# Altium schematic sheet originalPSU48.SchDoc
size A; SheetNumber: 10; SheetTotal: 10
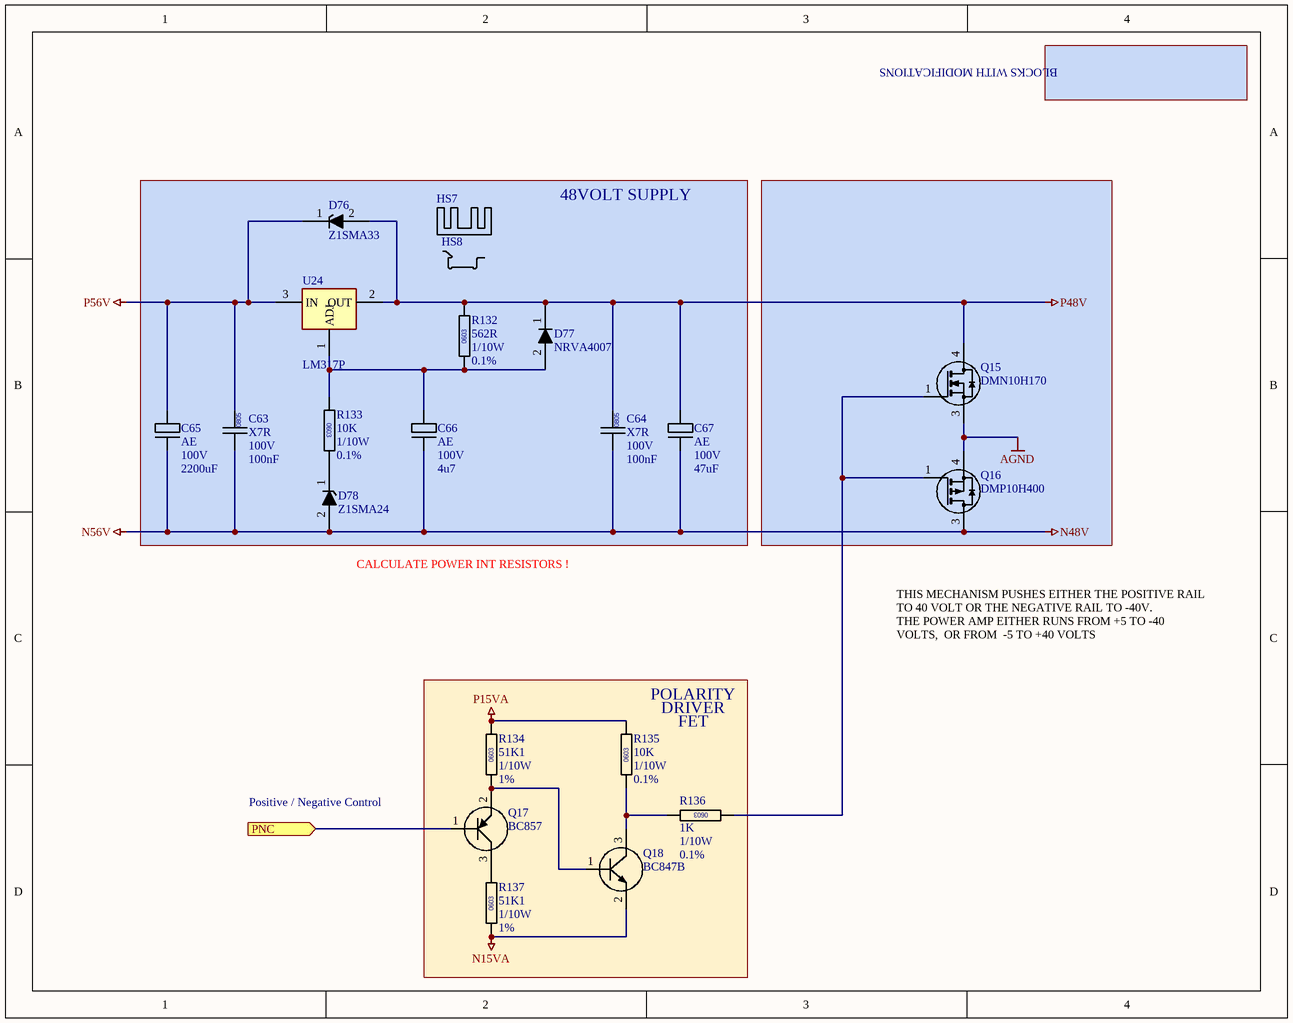
[diagram p0: originalPSU48.SchDoc]

## Parts
C63  Dielectric: X7R  Voltage: 100V  Capacitance: 100nF  [CAPC0805]  (hidden comment: CAP0805)
C64  Dielectric: X7R  Voltage: 100V  Capacitance: 100nF  [CAPC0805]  (hidden comment: CAP0805)
C65  Dielectric: AE  Voltage: 100V  Capacitance: 2200uF  [CAPAE-NICHICON-LGY2A222MELC30]  (hidden comment: CAP0603)
C66  Dielectric: AE  Voltage: 100V  Capacitance: 4u7  [CAPAE-PANASONIC-ECA-2AM4R7I]  (hidden comment: CAP0603)
C67  Dielectric: AE  Voltage: 100V  Capacitance: 47uF  [CAPAE-KEMET-ESL476M100AH9AA]  (hidden comment: CAP0603)
D76  Z1SMA33  [DO214AC]
D77  NRVA4007  [DO214AC]
D78  Z1SMA24  [DO214AC]
HS7  HEATSINK-CUI-HSS06-C20-P32  [HEATSINK-CUI-HSS06-C20-P32]  (value not drawn)
HS8  HEATSINK-CUI-HSC-05  [HEATSINK-CUI-HSS06-C20-P32]  (value not drawn)
Q15  DMN10H170  [DPAK]
Q16  DMP10H400  [DPAK]
Q17  BC857  [SOT23]
Q18  BC847B  [SOT23]
R132  value 562R  Power: 1/10W  Tolerance: 0.1%  [RESC0603]  (hidden comment: RESC0603)
R133  value 10K  Power: 1/10W  Tolerance: 0.1%  [RESC0603]  (hidden comment: RESC0603)
R134  value 51K1  Power: 1/10W  Tolerance: 1%  [RESC0603]  (hidden comment: RESC0603)
R135  value 10K  Power: 1/10W  Tolerance: 0.1%  [RESC0603]  (hidden comment: RESC0603)
R136  value 1K  Power: 1/10W  Tolerance: 0.1%  [RESC0603]  (hidden comment: RESC0603)
R137  value 51K1  Power: 1/10W  Tolerance: 1%  [RESC0603]  (hidden comment: RESC0603)
U24  LM317P  [TO220V-OVERMOLD]

## Blocks framed on the sheet
48VOLT SUPPLY: C63-C67 D76-D78 HS7 HS8 R132 R133 U24

## Ports
PNC (in)

## Nets
AGND: Q15.3(S) Q16.4(S)
N15VA: Q18.2(E) R137.2
N48V: C63.2 C64.2 C65.2 C66.2 C67.2 D78.2(A) Q16.3(D)  [also labelled N56V]
P15VA: R134.1 R135.1
P48V: C64.1 C67.1 D76.2(A) D77.1(K) Q15.4(D) R132.1 U24.2(OUT)
P56V: C63.1 C65.1 D76.1(K) U24.3(IN)
PNC: Q17.1(B) ; port PNC
NetC66_1: C66.1 D77.2(A) R132.2 R133.2 U24.1(ADJ)
NetD78_1: D78.1(K) R133.1
NetQ15_1: Q15.1(G1) Q16.1(G1) R136.2
NetQ17_2: Q17.2(E) Q18.1(B) R134.2
NetQ17_3: Q17.3(C) R137.1
NetQ18_3: Q18.3(C) R135.2 R136.1

## Notes on the sheet
- BLOCKS WITH MODIFICATIONS
- CALCULATE POWER INT RESISTORS !
- (near R135) POLARITY
- (near R135) DRIVER
- FET
- THIS MECHANISM PUSHES EITHER THE POSITIVE RAIL TO 40 VOLT OR THE NEGATIVE RAIL TO -40V.
  THE POWER AMP EITHER RUNS FROM +5 TO -40 VOLTS,  OR FROM  -5 TO +40 VOLTS
- Positive / Negative Control
- (in symbol CAPC-0805-100nF-100V) 0805
- (in symbol RESC-0603-1K-0.1%-1/10W) 0603
- (in symbol RESC-0603-10K-0.1%-1/10W) 0603
- (in symbol RESC-0603-51K1-1%-1/10W) 0603
- (in symbol RESC-0603-562R-0.1%-1/10W) 0603

## Library data of the parts
C63 C64 = CAPC-0805-100nF-100V: CAPACITOR,CERAMIC,100nF,100V,X7R,0805; Package / Case: 0805 (2012 metric); Location: *
C65 = CAPP-AE-2200uF-100V-TH100P350D320H: CAPACITOR,ALU,2200uF,100V,TH,P10mm,D35mm,H32mm,SNAP; Manufacturer 1: NICHICON; Manufacturer Part Number 1: LGY2A222MELC30; Location: *
C66 = CAPP-AE-4u7-100V-TH025P050D120H: CAPACITOR,ALU,4u7,100V,TH,P0.25mm,D50mm,H12mm; Manufacturer 1: PANASONIC; Manufacturer Part Number 1: ECA-2AM4R7I; Location: *
C67 = CAPP-AE-47uF-100V-TH050P100D140H: CAPACITOR,ALU,47uF,100V,TH,P5mm,D10mm,H14mm; Manufacturer 1: KEMET; Manufacturer Part Number 1: ESL476M100AH9AA; Location: *; DIGIKEY: 399-15746-ND
D76 = ZENER-DIOTEC-Z1SMA33: DIODE,ZENER,33V,1W,Z1SMA33,DO214AC(SMA); Manufacturer 1: DIOTEC; Manufacturer Part Number 1: Z1SMA24
D77 = DIODE-ONSEMI-NRVA4007T3G: DIODE,RECTIFIER,1000V,1A,ONSEMI,NRVA4007,SMA; DIGIKEY: NRVA4007T3GOSCT-ND; Manufacturer 1: ONSEMI; Manufacturer Part Number 1: NRVA4007T3G
D78 = ZENER-DIOTEC-Z1SMA24: DIODE,ZENER,24V,1W,Z1SMA24,DO214AC(SMA); Manufacturer 1: DIOTEC; Manufacturer Part Number 1: Z1SMA24
HS7 = HEATSINK-CUI-HSS06-C20-P32: HEATSINKSTAMPED,CLIP-ON,BOARDMOUNT,3W,25C/W,CUI,HSS06-C20-P32
HS8 = HEATSINK-CUI-HSC-05: HEATSINK,CLIP FOR HSS01-B20-CP; Manufacturer 1: CUI; DIGIKEY: HSS01-B20-CP; Manufacturer Part Number 1: HSS01-B20-CP
Q15 = XSTR-NMOS-DIODES-DMN10H170SK3-13: XSTR,NMOS,100V,12A,DMN10H170SK3-13,DPAK; Manufacturer 1: DIODES; Idmax: 5.6; Package: DPAK; Vds: 100V; Manufacturer Part Number 1: DMN10H170SK3-13
Q16 = XSTR-PMOS-DIODES-DMP10H400SK3-13: XSTR,PMOS,100V,5.6A,DMP10H400SK3-13,DPAK; Manufacturer 1: DIODES; Idmax: 9A; Package: DPAK; Vds: 100V; Manufacturer Part Number 1: DMP10H400SK3-13
Q17 = XSTR-PNP-BC857: XSTR,PNP,SOT23,BC857,SOT23
Q18 = XSTR-NPN-BC847: XSTR,NPN,45V,0.1A,,BC847B,SOT23
R132 = RESC-0603-562R-0.1%-1/10W: RESISTOR,562R,0.1%,100mW,0603 (1608); Location: *
R133 R135 = RESC-0603-10K-0.1%-1/10W: RESISTOR,10K,0.1%,100mW,0603 (1608); Location: *
R134 R137 = RESC-0603-51K1-1%-1/10W: RESISTOR,51K1,1%,100mW,0603 (1608); Location: *
R136 = RESC-0603-1K-0.1%-1/10W: RESISTOR,1K,0.1%,100mW,0603 (1608); Location: *
U24 = IC-ST-LM317P-TO220FP: IC,VOLTAGE REG,LIN,POSITIVE,ADJ,LM317P,TO220